# Altium schematic sheet TEMP.SchDoc
size A4; SheetNumber: 5; SheetTotal: 5
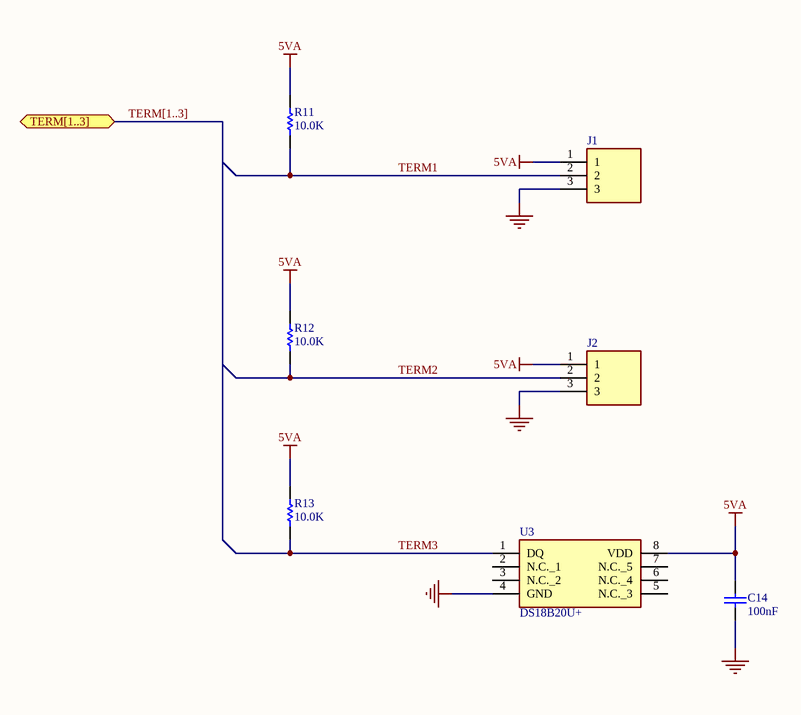
[diagram p0: TEMP.SchDoc]

## Parts
C14  value 100nF  [CAP_0603_H090 (_IPC_MD)]  (hidden comment: 100nF 0603)
J1  B3B-PH-K-S_LF__SN_  [SHDR3W50P0X200_1X3_790X450X600P]  (value not drawn)
J2  B3B-PH-K-S_LF__SN_  [SHDR3W50P0X200_1X3_790X450X600P]  (value not drawn)
R11  value 10.0K  [RES_0603_H050 (_IPC_MD)]  (hidden comment: 10.0K 1% 0,1W 75V 0603)
R12  value 10.0K  [RES_0603_H050 (_IPC_MD)]  (hidden comment: 10.0K 1% 0,1W 75V 0603)
R13  value 10.0K  [RES_0603_H050 (_IPC_MD)]  (hidden comment: 10.0K 1% 0,1W 75V 0603)
U3  DS18B20U+  [SOP65P490X110-8N]

## Ports
TERM[1..3] (bidir)

## Nets
5VA: C14.2 J1.1 J2.1 R11.1 R12.1 R13.1 U3.8(VDD)
GND: C14.1 J1.3 J2.3 U3.4(GND)
TERM1: J1.2 R11.2
TERM2: J2.2 R12.2
TERM3: R13.2 U3.1(DQ)

Not connected (* = marked no-connect by the designer): U3 2(N.C._1) 3(N.C._2) 5(N.C._3) 6(N.C._4) 7(N.C._5)

## Buses and harness runs
bus TERM[1..3] = port TERM[1..3]

## Library data of the parts
C14 = CL10B104KB8NNNC: CAP CER 100NF 50V X7R 0603; Type: Standard; Designator: C?; PCB Lib: MUAB_CAP.PcbLib; Scm Lib: Discrete.SchLib; Tol: 10%; Volt: 50V; Part Number: CL10B104KB8NNNC; Dielec: X7R; Qty: 1; Supplier 1: Arrow; Supplier 2: Avnet; Supplier 3: Digi-Key; Supplier Part Number 3: 1276-1000-1-ND; Supplier 4: Distrelec; Supplier 5: Farnell; Supplier 6: Future Electronics; Supplier 7: Mouser; Supplier Part Number 7: 187-CL10B104KB8NNNC; Supplier 8: RSComponents; Supplier 9: Rutronik; Supplier 10: SEED OPL
J1 J2 = B3B-PH-K-S_LF__SN_: Connector; Manufacturer_Name: JST (JAPAN SOLDERLESS TERMINALS); Manufacturer_Part_Number: B3B-PH-K-S(LF)(SN); Datasheet Link: http://www.jst-mfg.com/product/pdf/eng/ePH.pdf; Height: 6mm; Arrow Part Number: B3B-PH-K-S(LF)(SN); Arrow Price/Stock: https://www.arrow.com/en/products/b3b-ph-k-s-lf-sn/jst-manufacturing; RS-Online: 8201431P
R11-R13 = RES10.0K1%0603: Designator: R; PCB Lib: MUAB_RES.PcbLib; Scm Lib: Discrete.SchLib; Watt: 0,1W; Tol: 1%; Part Number: RES10.0K1%0603; Type: Standard; Volt: 75V; Qty: 1; Supplier 1: Arrow; Supplier 2: Avnet; Supplier 3: Digi-Key; Supplier 4: Distrelec; Supplier 5: Farnell; Supplier 6: Future Electronics; Supplier 7: Mouser; Supplier 8: RSComponents; Supplier 9: Rutronik; Supplier 10: SEED OPL
U3 = DS18B20U+: Te,perature sensor; Manufacturer_Name: Maxim Integrated; Datasheet Link: https://datasheets.maximintegrated.com/en/ds/DS18B20.pdf; Height: 1.1mm; Manufacturer_Part_Number: DS18B20U+; Mouser Part Number: 700-DS18B20U; Mouser Price/Stock: https://www.mouser.co.uk/ProductDetail/Maxim-Integrated/DS18B20U%2b?qs=7H2Jq%252ByxpJLxAEcPXZtrFQ%3D%3D; Arrow Part Number: DS18B20U+; Arrow Price/Stock: https://www.arrow.com/en/products/ds18b20u/maxim-integrated?region=nac; Supplier 1: RSComponents; Supplier Part Number 1: 1901809P